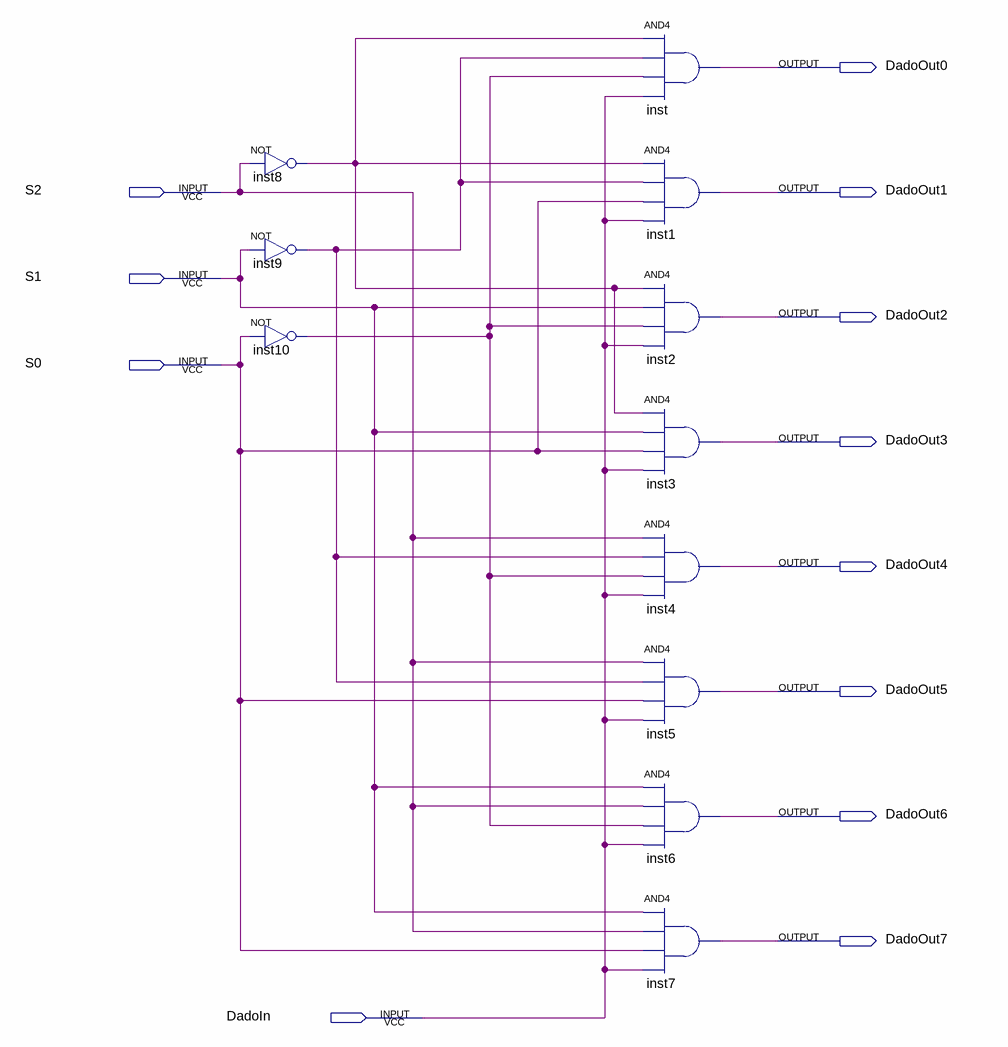
[diagram p0: schematic sheet]
// Quartus schematic Demux81.bdf as structural Verilog: 11 symbols, 12 pins
module Demux81 (
  input  S2,
  input  S1,
  input  S0,
  input  DadoIn,
  output DadoOut0,
  output DadoOut1,
  output DadoOut2,
  output DadoOut3,
  output DadoOut4,
  output DadoOut5,
  output DadoOut6,
  output DadoOut7
);

  wire inst8_out, inst9_out, inst10_out;

  not inst8 (inst8_out, S2);
  not inst9 (inst9_out, S1);
  not inst10 (inst10_out, S0);
  and inst (DadoOut0, inst8_out, inst9_out, inst10_out, DadoIn);
  and inst1 (DadoOut1, inst8_out, inst9_out, S0, DadoIn);
  and inst2 (DadoOut2, inst8_out, S1, inst10_out, DadoIn);
  and inst3 (DadoOut3, inst8_out, S1, S0, DadoIn);
  and inst4 (DadoOut4, S2, inst9_out, inst10_out, DadoIn);
  and inst5 (DadoOut5, S2, inst9_out, S0, DadoIn);
  and inst6 (DadoOut6, S1, S2, inst10_out, DadoIn);
  and inst7 (DadoOut7, S1, S2, S0, DadoIn);
endmodule
